# Altium schematic sheet [3]USB.SchDoc
size B
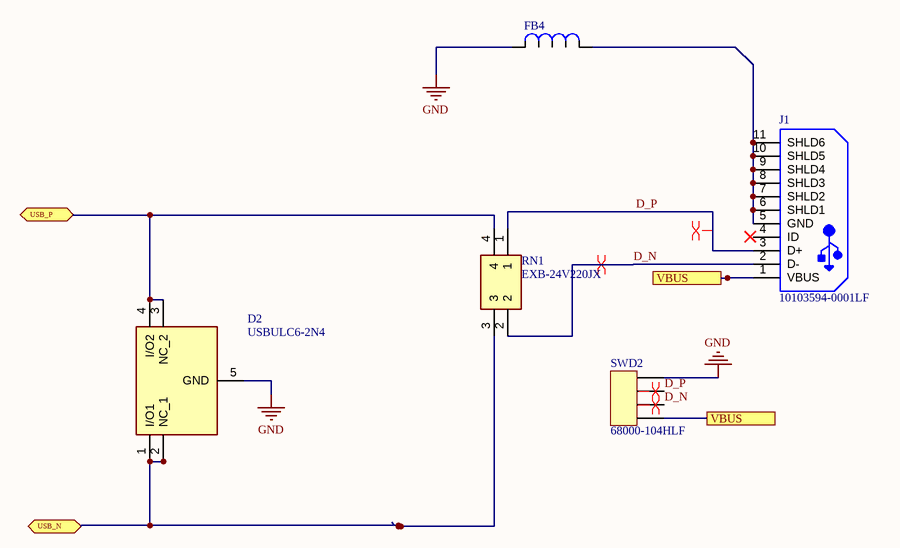
[diagram p0: [3]USB.SchDoc]

## Parts
D2  USBULC6-2N4  [SON40P100X80X55-5N-D]
FB4  BLM18AG102SN1D  [Ferrite Bead]  (value not drawn)
J1  10103594-0001LF  [FCI-10103594-0001LF_V]
RN1  EXB-24V220JX  [EXB24V220JX]
SWD2  68000-104HLF  [4POS_HEADER]

## Ports
USB_N (bidir), USB_P (bidir), VBUS

## Nets
GND: D2.5(GND) FB4.2 SWD2.1
D_N: J1.2(D-) RN1.2 SWD2.3
D_P: J1.3(D+) RN1.1 SWD2.2
USB_N: D2.1(I/O1) D2.2(NC_1) RN1.3 ; port USB_N
USB_P: D2.3(NC_2) D2.4(I/O2) RN1.4 ; port USB_P
VBUS: J1.1(VBUS) SWD2.4 ; port VBUS
NetFB4_1: FB4.1 J1.5(GND) J1.6(SHLD1) J1.7(SHLD2) J1.8(SHLD3) J1.9(SHLD4) J1.10(SHLD5) J1.11(SHLD6)

Not connected (* = marked no-connect by the designer): J1 4(ID)

## Layout directives
differential pair; differential pair class USBPair1: (no net found under the mark), D_N, D_P

## Notes on the sheet
- 8
- 7
- 6
- 5
- 4
- 3
- DWG. NO.
- REV.
- SHT.
- REVISION
- 2
- DESCRIPTION
- DATE
- 1
- APPROVED
- THIS DOCUMENT AND THE DATA DISCLOSED HEREIN OR HEREWITH IS THE PROPERTY OF ALTIUM LIMITED AND MAY BE FREELY DISTRIBUTED IN WHOLE. NO RIGHTS ARE RESERVED OR EXPRESS OR IMPLIED WARANTEE GIVEN.
- F
- E
- D
- C
- B
- A
- SCALE:
- A3
- SIZE
- CAGE CODE
- FILE NAME
- DWG NO.
- SHEET
- OF
- REV

## Library data of the parts
D2 = USBULC6-2N4: TVS Diode (Bi-directional); Manufacturer_Name: STMicroelectronics; Datasheet Link: https://www.mouser.com/datasheet/2/389/usbulc6-2n4-957402.pdf; Height: 0.55mm; Manufacturer_Part_Number: USBULC6-2N4; Arrow Part Number: USBULC6-2N4; Arrow Price/Stock: https://www.arrow.com/en/products/usbulc6-2n4/stmicroelectronics; Mouser Part Number: 511-USBULC6-2N4; Mouser Price/Stock: https://www.mouser.co.uk/ProductDetail/STMicroelectronics/USBULC6-2N4?qs=Rlwi1sSxVL7F1p%2FNjkpR0Q%3D%3D
FB4 = Ferrite Bead: Ferrite Bead 1KOhm @100MHz; Datasheet: https://www.murata.com/en-us/products/productdata/8796738650142/ENFA0003.pdf?src-supplier=Digi-Key; Supplier 1: Mouser; Supplier Part Number 1: 81-BLM11A102S; PN: BLM18AG102SN1D
J1 = CMP-002-00038-1: Micro USB 2.0 B Receptacle, 5 Position, Height 3.24 mm, -55 to 85 degC, RoHS, Tape and Reel; Manufacturer: FCI Electronics; Voltage Rating: 100V; Gender: Female; Current Rating: 1.8A; Min Operating Temperature: -55°C; Pins: 5; Contact Plating: Gold; Package Description: 5-Pin Surface Mount Device, Body 8.04 x 5.62 mm; RoHS Compliant: True; Lead Pitch: 0.65mm; Packaging: TapeandReel; Case/Package: FCI-10103594-0001LF; Manufacturer URL: http://portal.fciconnect.com/; Mounting Technology: SM; Datasheet Version: Rev. A, 06/2010; Connector Type: USB; Contact Material: Copper; Datasheet URL: http://portal.fciconnect.com/Comergent//fci/drawing/10103594.pdf; Max Operating Temperature: 85°C; Package Quantity: 1500; Package Reference: FCI-10103594-0001LF
RN1 = EXB-24V220JX: Resistor Network; Manufacturer_Name: Panasonic; Datasheet Link: https://www.snapeda.com/parts/EXB-24V220JX/Panasonic%20Electronic/datasheet/; Height: 0.45mm; Manufacturer_Part_Number: EXB-24V220JX; Mouser Part Number: 667-EXB-24V220JX; Mouser Price/Stock: https://www.mouser.co.uk/ProductDetail/Panasonic/EXB-24V220JX?qs=oE3VwAv%2FYtkKhK0m4TkqFQ%3D%3D
SWD2 = 68000-104HLF: 4 Positions Header, Unshrouded Connector 0.100" (2.54mm) Through Hole Gold or Gold, GXT™; Manufacturer 1: Amphenol FCI; Number of Positions: 4; Gender: Male; Connector Type: Male Pin; Voltage Rating: 1.5kV; Current Rating: 3A; Insulation Resistance: 5GR; Mating Post Length: 5.84mm; Mount: Through Hole; Colour: Black; Housing Colour: Black; Housing Material: Thermoplastic; Contact Plating: Nickel,Gold,GXT; Contact Material: Bronze; Min Operating Temperature: -65°C; Max Operating Temperature: 125°C; Number of Rows: 1; Packaging: Bulk; Package Quantity: 100; Termination: Solder; Number of Contacts: 4; Orientation: Straight; Max Voltage Rating (AC): 1.5kV; Contact Gender: Male; Length: 10.16mm; Pitch: 2.54mm; Depth: 2.41mm; Termination Post Length: 2.41mm; Contact Mating Length: 0.23inch; Radiation Hardening: No; REACH SVHC: No SVHC; Flammability Rating: UL94 V-0; ComponentLink1URL: https://datasheet.ciiva.com/16726/68000-16726213.pdf; ComponentLink1Description: https://datasheet.ciiva.com/16726/68000-16726213.pdf; ComponentLink2URL: https://datasheet.ciiva.com/10149/68000-10149830.pdf; ComponentLink2Description: https://datasheet.ciiva.com/10149/68000-10149830.pdf; ComponentLink3URL: https://datasheet.ciiva.com/46395/1914865-46395854.pdf; ComponentLink3Description: https://datasheet.ciiva.com/46395/1914865-46395854.pdf; ComponentLink4URL: https://datasheet.ciiva.com/728/68000-728879.pdf; ComponentLink4Description: https://datasheet.ciiva.com/728/68000-728879.pdf; Description 1: 4 Positions Header, Unshrouded Connector 0.100" (2.54mm) Through Hole Gold or Gold, GXT™; Manufacturer Part Number 1: 68000-104HLF; Pricing 1: 1=0.33, 10=0.316, 100=0.2212, 500=0.18964, 1000=0.15803, 5000=0.13545, 10000=0.12642 (USD); Stock 1: 10785; Supplier 1: Digi-Key; Supplier Part Number 1: 609-3248-ND